# EAGLE schematic lcd-interface (EAGLE 5.02)
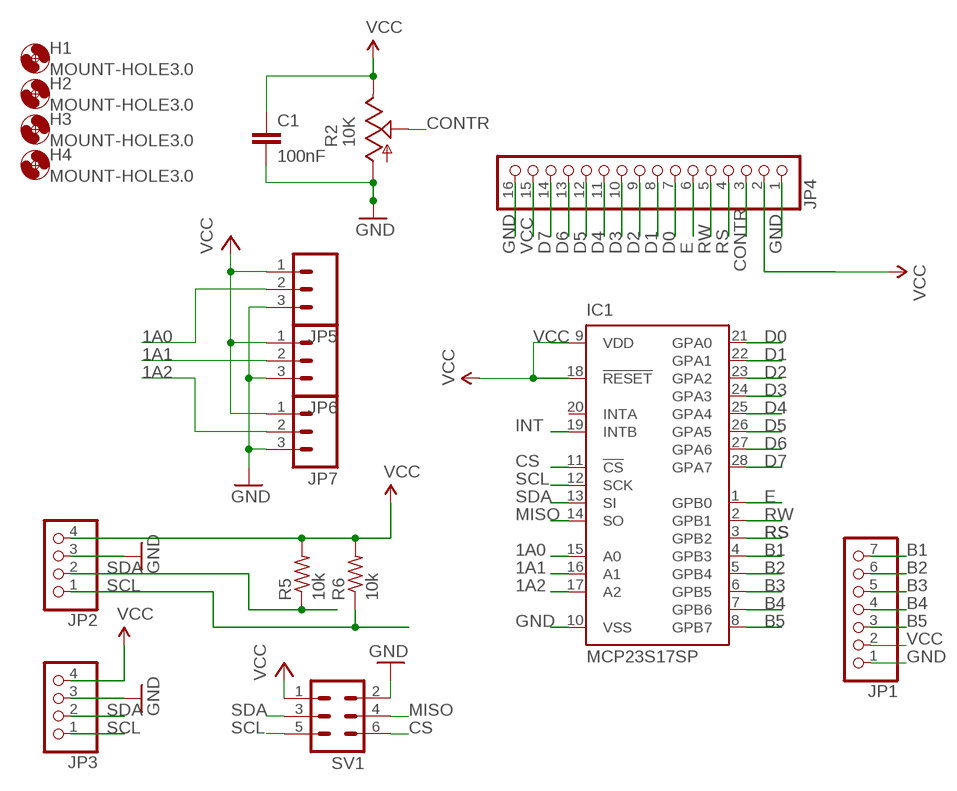
[diagram p0: schematic, sheet 1]

## Parts
C1  100nF  C-EU050-030X075  [C050-030X075]
H1  MOUNT-HOLE3.0  [3,0]
H2  MOUNT-HOLE3.0  [3,0]
H3  MOUNT-HOLE3.0  [3,0]
H4  MOUNT-HOLE3.0  [3,0]
IC1  MCP23S17SP  [DIL28-3]
JP1  PINHD-1X7  [1X07]
JP2  PINHD-1X4  [1X04]
JP3  PINHD-1X4  [1X04]
JP4  PINHD-1X16  [1X16]
JP5  M03PTH  [1X03]
JP6  M03PTH  [1X03]
JP7  M03PTH  [1X03]
R2  10K  TRIM_US-B25P  [B25P]
R5  10k  R-US_0207/7  [0207/7]
R6  10k  R-US_0207/7  [0207/7]
SV1  ML6  [ML6]

## Nets
1A0: IC1.15(A0) JP5.2
1A1: IC1.16(A1) JP6.2
1A2: IC1.17(A2) JP7.2
B1: IC1.4(GPB3) JP1.7
B2: IC1.5(GPB4) JP1.6
B3: IC1.6(GPB5) JP1.5
B4: IC1.7(GPB6) JP1.4
B5: IC1.8(GPB7) JP1.3
CONTR: JP4.3 R2.S
CS: IC1.11(!CS) SV1.6
D0: IC1.21(GPA0) JP4.7
D1: IC1.22(GPA1) JP4.8
D2: IC1.23(GPA2) JP4.9
D3: IC1.24(GPA3) JP4.10
D4: IC1.25(GPA4) JP4.11
D5: IC1.26(GPA5) JP4.12
D6: IC1.27(GPA6) JP4.13
D7: IC1.28(GPA7) JP4.14
E: IC1.1(GPB0) JP4.6
GND: C1.2 IC1.10(VSS) JP1.1 JP2.3 JP3.3 JP4.1 JP4.16 JP5.3 JP6.3 JP7.3 R2.A SV1.2
INT: IC1.19(INTB)
MISO: IC1.14(SO) SV1.4
RS: IC1.3(GPB2) JP4.4
RW: IC1.2(GPB1) JP4.5
SCL: IC1.12(SCK) JP2.1 JP3.1 R6.1 SV1.5
SDA: IC1.13(SI) JP2.2 JP3.2 R5.1 SV1.3
VCC: C1.1 IC1.9(VDD) IC1.18(!RESET) JP1.2 JP2.4 JP3.4 JP4.2 JP4.15 JP5.1 JP6.1 JP7.1 R2.E R5.2 R6.2 SV1.1
Unconnected: IC1.20(INTA)

## Library data of the parts
C1 = rcl:C-EU: CAPACITOR, European symbol
H1-H4 = holes:MOUNT-HOLE: MOUNTING HOLE with drill center marker
IC1 = microchip:MCP23S17: http://ww1.microchip.com/downloads/en/DeviceDoc/21952a.pdf Source: http://ww1.microchip.com/downloads/en/DeviceDoc/21952a.pdf
JP1 = pinhead:PINHD-1X7: PIN HEADER
JP2 JP3 = pinhead:PINHD-1X4: PIN HEADER
JP4 = pinhead:PINHD-1X16: PIN HEADER
JP5-JP7 = SparkFun:M03: Header 3 Standard 3-pin 0.1" header. Use with straight break away headers (SKU : PRT-00116), right angle break away headers (PRT-00553), swiss pins (PRT-00743), machine pins (PRT-00117), and female headers (PRT-00115). Molex polarized connector foot print use with SKU : PRT-08232 with associated crimp pins and housings.
R2 = pot:TRIM_US-: POTENTIOMETER
R5 R6 = resistor:R-US_: RESISTOR, American symbol
SV1 = con-harting-ml:ML6: HARTING